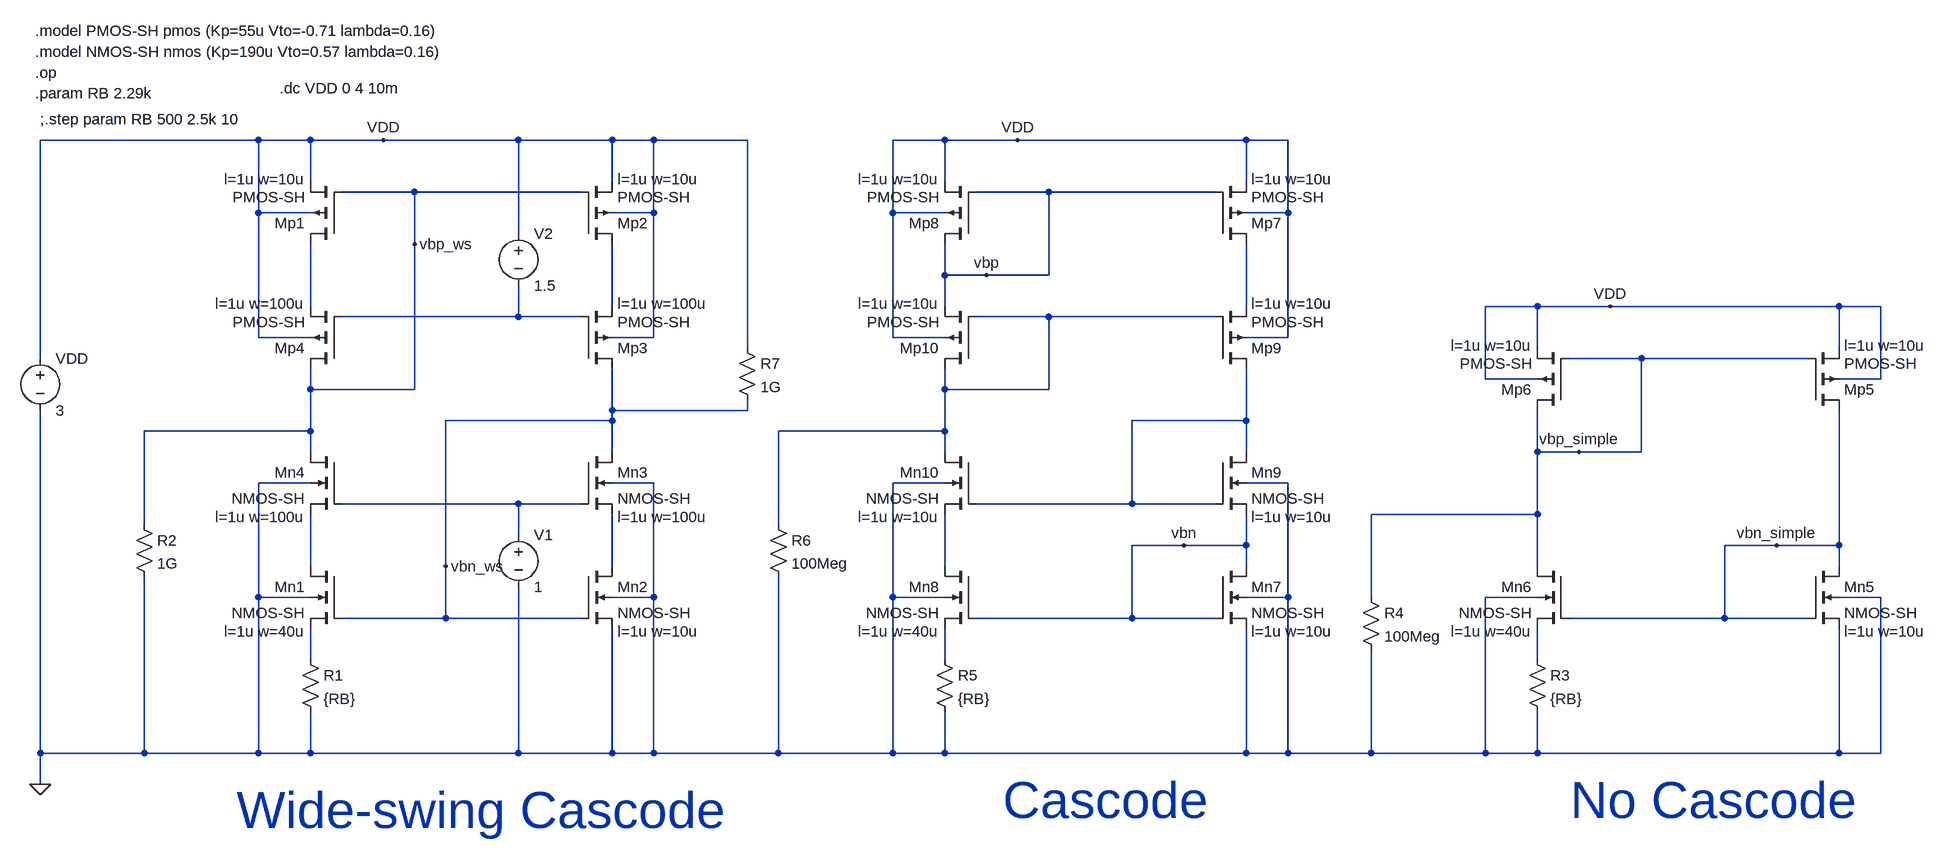
[diagram p0: schematic 3_bias_4trans_casc_wide_swing.asc]
3_bias_4trans_casc_wide_swing.asc, the LTspice schematic file:
Version 4
SHEET 1 1724 1028
WIRE -864 -64 -1200 -64
WIRE -784 -64 -864 -64
WIRE -672 -64 -784 -64
WIRE -464 -64 -672 -64
WIRE -320 -64 -464 -64
WIRE -256 -64 -320 -64
WIRE -112 -64 -256 -64
WIRE 192 -64 112 -64
WIRE 304 -64 192 -64
WIRE 656 -64 304 -64
WIRE 720 -64 656 -64
WIRE -784 0 -784 -64
WIRE -320 0 -320 -64
WIRE 192 0 192 -64
WIRE 656 0 656 -64
WIRE -624 16 -736 16
WIRE -368 16 -624 16
WIRE 352 16 240 16
WIRE 608 16 352 16
WIRE -864 48 -864 -64
WIRE -784 48 -864 48
WIRE -256 48 -256 -64
WIRE -256 48 -320 48
WIRE 112 48 112 -64
WIRE 192 48 112 48
WIRE 720 48 720 -64
WIRE 720 48 656 48
WIRE -464 80 -464 -64
WIRE -624 96 -624 16
WIRE 192 144 192 96
WIRE 256 144 192 144
WIRE 352 144 352 16
WIRE 352 144 256 144
WIRE -784 192 -784 96
WIRE -320 192 -320 96
WIRE 192 192 192 144
WIRE 656 192 656 96
WIRE 1104 192 1024 192
WIRE 1216 192 1104 192
WIRE 1568 192 1216 192
WIRE 1632 192 1568 192
WIRE -464 208 -464 160
WIRE -464 208 -736 208
WIRE -368 208 -464 208
WIRE 352 208 240 208
WIRE 608 208 352 208
WIRE -864 240 -864 48
WIRE -784 240 -864 240
WIRE -256 240 -256 48
WIRE -256 240 -320 240
WIRE 112 240 112 48
WIRE 192 240 112 240
WIRE 720 240 720 48
WIRE 720 240 656 240
WIRE -112 256 -112 -64
WIRE 1104 256 1104 192
WIRE 1568 256 1568 192
WIRE -1200 272 -1200 -64
WIRE 1264 272 1152 272
WIRE 1520 272 1264 272
WIRE 1024 304 1024 192
WIRE 1104 304 1024 304
WIRE 1632 304 1632 192
WIRE 1632 304 1568 304
WIRE -784 320 -784 288
WIRE -624 320 -624 96
WIRE -624 320 -784 320
WIRE 192 320 192 288
WIRE 352 320 352 208
WIRE 352 320 192 320
WIRE -320 352 -320 288
WIRE -112 352 -112 336
WIRE -112 352 -320 352
WIRE -320 368 -320 352
WIRE -320 368 -576 368
WIRE 656 368 656 288
WIRE 656 368 480 368
WIRE -784 384 -784 320
WIRE -784 384 -1040 384
WIRE 192 384 192 320
WIRE 192 384 -64 384
WIRE -784 416 -784 384
WIRE -320 416 -320 368
WIRE 192 416 192 384
WIRE 656 416 656 368
WIRE 1104 416 1104 352
WIRE 1168 416 1104 416
WIRE 1264 416 1264 272
WIRE 1264 416 1168 416
WIRE -784 464 -864 464
WIRE -256 464 -320 464
WIRE 192 464 112 464
WIRE 720 464 656 464
WIRE -464 496 -736 496
WIRE -368 496 -464 496
WIRE 480 496 480 368
WIRE 480 496 240 496
WIRE 608 496 480 496
WIRE 1104 512 1104 416
WIRE 1104 512 848 512
WIRE -1040 528 -1040 384
WIRE -64 528 -64 384
WIRE -464 544 -464 496
WIRE 560 560 480 560
WIRE 656 560 656 512
WIRE 656 560 560 560
WIRE 1472 560 1392 560
WIRE 1568 560 1568 352
WIRE 1568 560 1472 560
WIRE -784 592 -784 512
WIRE -576 592 -576 368
WIRE -320 592 -320 512
WIRE 192 592 192 512
WIRE 656 592 656 560
WIRE 1104 592 1104 512
WIRE 1568 592 1568 560
WIRE -864 640 -864 464
WIRE -784 640 -864 640
WIRE -256 640 -256 464
WIRE -256 640 -320 640
WIRE 112 640 112 464
WIRE 192 640 112 640
WIRE 720 640 720 464
WIRE 720 640 656 640
WIRE 848 640 848 512
WIRE 1104 640 1024 640
WIRE 1632 640 1568 640
WIRE -576 672 -576 592
WIRE -576 672 -736 672
WIRE -368 672 -576 672
WIRE 480 672 480 560
WIRE 480 672 240 672
WIRE 608 672 480 672
WIRE 1392 672 1392 560
WIRE 1392 672 1152 672
WIRE 1520 672 1392 672
WIRE -784 736 -784 688
WIRE 192 736 192 688
WIRE 1104 736 1104 688
WIRE -1200 880 -1200 352
WIRE -1040 880 -1040 608
WIRE -1040 880 -1200 880
WIRE -864 880 -864 640
WIRE -864 880 -1040 880
WIRE -784 880 -784 816
WIRE -784 880 -864 880
WIRE -464 880 -464 624
WIRE -464 880 -784 880
WIRE -320 880 -320 688
WIRE -320 880 -464 880
WIRE -256 880 -256 640
WIRE -256 880 -320 880
WIRE -64 880 -64 608
WIRE -64 880 -256 880
WIRE 112 880 112 640
WIRE 112 880 -64 880
WIRE 192 880 192 816
WIRE 192 880 112 880
WIRE 656 880 656 688
WIRE 656 880 192 880
WIRE 720 880 720 640
WIRE 720 880 656 880
WIRE 848 880 848 720
WIRE 848 880 720 880
WIRE 1024 880 1024 640
WIRE 1024 880 848 880
WIRE 1104 880 1104 816
WIRE 1104 880 1024 880
WIRE 1568 880 1568 688
WIRE 1568 880 1104 880
WIRE 1632 880 1632 640
WIRE 1632 880 1568 880
WIRE -1200 928 -1200 880
FLAG -1200 928 0
FLAG -672 -64 VDD
FLAG 1216 192 VDD
FLAG 1168 416 vbp_simple
FLAG 1472 560 vbn_simple
FLAG -624 96 vbp_ws
FLAG -576 592 vbn_ws
FLAG 304 -64 VDD
FLAG 256 144 vbp
FLAG 560 560 vbn
SYMBOL nmos4 -368 592 R0
WINDOW 123 56 100 Left 2
SYMATTR Value2 l=1u w=10u
SYMATTR InstName Mn2
SYMATTR Value NMOS-SH
SYMBOL pmos4 -368 96 M180
WINDOW 123 56 100 Left 2
SYMATTR Value2 l=1u w=10u
SYMATTR InstName Mp2
SYMATTR Value PMOS-SH
SYMBOL nmos4 -736 592 M0
WINDOW 123 56 100 Left 2
SYMATTR Value2 l=1u w=40u
SYMATTR InstName Mn1
SYMATTR Value NMOS-SH
SYMBOL res -800 720 R0
SYMATTR InstName R1
SYMATTR Value {RB}
SYMBOL voltage -1200 256 R0
WINDOW 123 0 0 Left 2
WINDOW 39 0 0 Left 2
SYMATTR InstName VDD
SYMATTR Value 3
SYMBOL pmos4 -736 96 R180
WINDOW 123 56 100 Left 2
SYMATTR Value2 l=1u w=10u
SYMATTR InstName Mp1
SYMATTR Value PMOS-SH
SYMBOL res -1056 512 R0
SYMATTR InstName R2
SYMATTR Value 1G
SYMBOL nmos4 -368 416 R0
WINDOW 123 56 100 Left 2
SYMATTR Value2 l=1u w=100u
SYMATTR InstName Mn3
SYMATTR Value NMOS-SH
SYMBOL nmos4 -736 416 M0
WINDOW 123 56 100 Left 2
SYMATTR Value2 l=1u w=100u
SYMATTR InstName Mn4
SYMATTR Value NMOS-SH
SYMBOL pmos4 -368 288 M180
WINDOW 123 56 100 Left 2
SYMATTR Value2 l=1u w=100u
SYMATTR InstName Mp3
SYMATTR Value PMOS-SH
SYMBOL pmos4 -736 288 R180
WINDOW 123 56 100 Left 2
SYMATTR Value2 l=1u w=100u
SYMATTR InstName Mp4
SYMATTR Value PMOS-SH
SYMBOL nmos4 1520 592 R0
WINDOW 123 56 100 Left 2
SYMATTR Value2 l=1u w=10u
SYMATTR InstName Mn5
SYMATTR Value NMOS-SH
SYMBOL pmos4 1520 352 M180
WINDOW 123 56 100 Left 2
SYMATTR Value2 l=1u w=10u
SYMATTR InstName Mp5
SYMATTR Value PMOS-SH
SYMBOL nmos4 1152 592 M0
WINDOW 123 56 100 Left 2
SYMATTR Value2 l=1u w=40u
SYMATTR InstName Mn6
SYMATTR Value NMOS-SH
SYMBOL res 1088 720 R0
SYMATTR InstName R3
SYMATTR Value {RB}
SYMBOL pmos4 1152 352 R180
WINDOW 123 56 100 Left 2
SYMATTR Value2 l=1u w=10u
SYMATTR InstName Mp6
SYMATTR Value PMOS-SH
SYMBOL res 832 624 R0
SYMATTR InstName R4
SYMATTR Value 100Meg
SYMBOL nmos4 608 592 R0
WINDOW 123 56 100 Left 2
SYMATTR Value2 l=1u w=10u
SYMATTR InstName Mn7
SYMATTR Value NMOS-SH
SYMBOL pmos4 608 96 M180
WINDOW 123 56 100 Left 2
SYMATTR Value2 l=1u w=10u
SYMATTR InstName Mp7
SYMATTR Value PMOS-SH
SYMBOL nmos4 240 592 M0
WINDOW 123 56 100 Left 2
SYMATTR Value2 l=1u w=40u
SYMATTR InstName Mn8
SYMATTR Value NMOS-SH
SYMBOL res 176 720 R0
SYMATTR InstName R5
SYMATTR Value {RB}
SYMBOL pmos4 240 96 R180
WINDOW 123 56 100 Left 2
SYMATTR Value2 l=1u w=10u
SYMATTR InstName Mp8
SYMATTR Value PMOS-SH
SYMBOL res -80 512 R0
SYMATTR InstName R6
SYMATTR Value 100Meg
SYMBOL nmos4 608 416 R0
WINDOW 123 56 100 Left 2
SYMATTR Value2 l=1u w=10u
SYMATTR InstName Mn9
SYMATTR Value NMOS-SH
SYMBOL nmos4 240 416 M0
WINDOW 123 56 100 Left 2
SYMATTR Value2 l=1u w=10u
SYMATTR InstName Mn10
SYMATTR Value NMOS-SH
SYMBOL pmos4 608 288 M180
WINDOW 123 56 100 Left 2
SYMATTR Value2 l=1u w=10u
SYMATTR InstName Mp9
SYMATTR Value PMOS-SH
SYMBOL pmos4 240 288 R180
WINDOW 123 56 100 Left 2
SYMATTR Value2 l=1u w=10u
SYMATTR InstName Mp10
SYMATTR Value PMOS-SH
SYMBOL voltage -464 528 R0
SYMATTR InstName V1
SYMATTR Value 1
SYMBOL voltage -464 64 R0
SYMATTR InstName V2
SYMATTR Value 1.5
SYMBOL res -128 240 R0
SYMATTR InstName R7
SYMATTR Value 1G
TEXT -1208 -200 Left 2 !.model NMOS-SH nmos (Kp=190u Vto=0.57 lambda=0.16)
TEXT -1208 -168 Left 2 !.op
TEXT -1208 -232 Left 2 !.model PMOS-SH pmos (Kp=55u Vto=-0.71 lambda=0.16)
TEXT -1208 -136 Left 2 !.param RB 2.29k
TEXT -1200 -96 Left 2 !;.step param RB 500 2.5k 10
TEXT -832 -144 Left 2 !.dc VDD 0 4 10m
TEXT 1376 952 Center 6 ;No Cascode
TEXT 440 952 Center 6 ;Cascode
TEXT -520 968 Center 6 ;Wide-swing Cascode

The netlist it stands for:
* 3_bias_4trans_casc_wide_swing.asc
Mn2 N009 vbn_ws 0 0 NMOS-SH l=1u w=10u
Mp2 N002 vbp_ws VDD VDD PMOS-SH l=1u w=10u
Mn1 N008 vbn_ws N011 0 NMOS-SH l=1u w=40u
R1 N011 0 {RB}
VDD VDD 0 3
Mp1 N001 vbp_ws VDD VDD PMOS-SH l=1u w=10u
R2 vbp_ws 0 1G
Mn3 vbn_ws N007 N009 0 NMOS-SH l=1u w=100u
Mn4 vbp_ws N007 N008 0 NMOS-SH l=1u w=100u
Mp3 vbn_ws N004 N002 VDD PMOS-SH l=1u w=100u
Mp4 vbp_ws N004 N001 VDD PMOS-SH l=1u w=100u
Mn5 vbn_simple vbn_simple 0 0 NMOS-SH l=1u w=10u
Mp5 vbn_simple vbp_simple VDD VDD PMOS-SH l=1u w=10u
Mn6 vbp_simple vbn_simple N013 0 NMOS-SH l=1u w=40u
R3 N013 0 {RB}
Mp6 vbp_simple vbp_simple VDD VDD PMOS-SH l=1u w=10u
R4 vbp_simple 0 100Meg
Mn7 vbn vbn 0 0 NMOS-SH l=1u w=10u
Mp7 N003 vbp VDD VDD PMOS-SH l=1u w=10u
Mn8 N010 vbn N012 0 NMOS-SH l=1u w=40u
R5 N012 0 {RB}
Mp8 vbp vbp VDD VDD PMOS-SH l=1u w=10u
R6 N005 0 100Meg
Mn9 N006 N006 vbn 0 NMOS-SH l=1u w=10u
Mn10 N005 N006 N010 0 NMOS-SH l=1u w=10u
Mp9 N006 N005 N003 VDD PMOS-SH l=1u w=10u
Mp10 N005 N005 vbp VDD PMOS-SH l=1u w=10u
V1 N007 0 1
V2 VDD N004 1.5
R7 VDD vbn_ws 1G
.model NMOS NMOS
.model PMOS PMOS
.lib standard.mos
.model NMOS-SH nmos (Kp=190u Vto=0.57 lambda=0.16)
.op
.model PMOS-SH pmos (Kp=55u Vto=-0.71 lambda=0.16)
.param RB 2.29k
;.step param RB 500 2.5k 10
.dc VDD 0 4 10m
* No Cascode
* Cascode
* Wide-swing Cascode
.backanno
.end